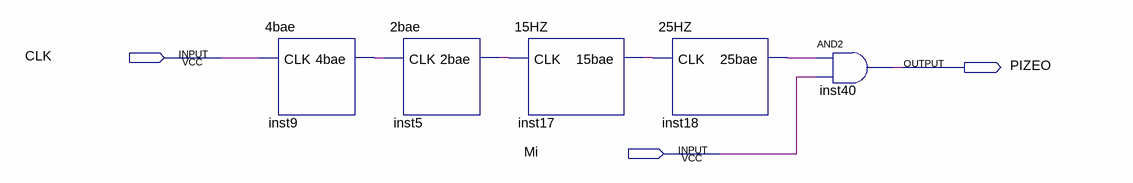
[diagram p0: schematic sheet]
// Quartus schematic Mi.bdf as structural Verilog: 5 symbols, 3 pins
module Mi (
  input  CLK,
  input  Mi,
  output PIZEO
);

  wire inst5_2bae, inst9_4bae, inst17_15bae, inst18_25bae;

  \4bae  inst9 (.CLK(CLK), .\4bae (inst9_4bae));
  \2bae  inst5 (.CLK(inst9_4bae), .\2bae (inst5_2bae));
  \15HZ  inst17 (.CLK(inst5_2bae), .\15bae (inst17_15bae));
  \25HZ  inst18 (.CLK(inst17_15bae), .\25bae (inst18_25bae));
  and inst40 (PIZEO, inst18_25bae, Mi);
endmodule
